# Altium schematic sheet Main.SchDoc: Top level
size A4; Engineer: CT; SheetNumber: 1; SheetTotal: 5
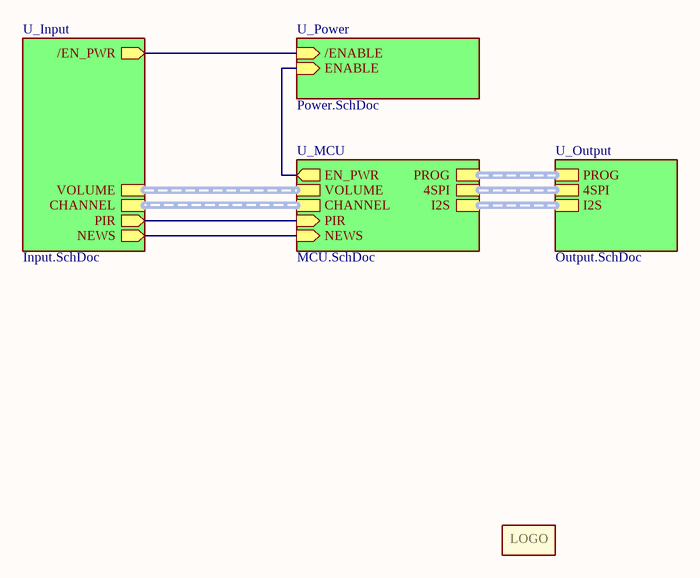
[diagram p0: Main.SchDoc]

## Parts
M1  Logo  [LOGO_9x6mm]  (value not drawn)  (no BOM)

## Sub-sheets
U_Input = Input.SchDoc: /EN_PWR (out), VOLUME (harness ROTENC), CHANNEL (harness ROTENC), PIR (out), NEWS (out)
U_MCU = MCU.SchDoc: 4SPI (harness 4SPI), PROG (harness PROG), VOLUME (harness ROTENC), CHANNEL (harness ROTENC), PIR (in), EN_PWR (out), NEWS (in), I2S (harness I2S)
U_Output = Output.SchDoc: PROG (harness PROG), 4SPI (harness 4SPI), I2S (harness I2S)
U_Power = Power.SchDoc: /ENABLE (in), ENABLE (in)

## Nets
(unnamed): sheet U_Input//EN_PWR, sheet U_Power//ENABLE
(unnamed): sheet U_Input/PIR, sheet U_MCU/PIR
(unnamed): sheet U_Input/NEWS, sheet U_MCU/NEWS
(unnamed): sheet U_MCU/EN_PWR, sheet U_Power/ENABLE

## Buses and harness runs
harness sheet U_Input/CHANNEL = sheet U_MCU/CHANNEL
harness sheet U_Input/VOLUME = sheet U_MCU/VOLUME
harness sheet U_MCU/4SPI = sheet U_Output/4SPI
harness sheet U_MCU/I2S = sheet U_Output/I2S
harness sheet U_MCU/PROG = sheet U_Output/PROG

## Notes on the sheet
- Title
- Sheet Revision:
- Link:
- Size:
- Project:
- Engineer:
- A4
- Date:
- Sheet
- of
- File:
- (in symbol Logo) LOGO